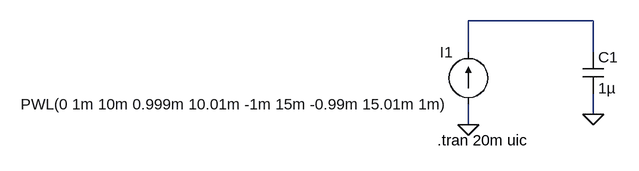
[diagram p0: schematic simple_integrate.asc]
simple_integrate.asc, the LTspice schematic file:
Version 4
SHEET 1 880 680
WIRE 384 64 192 64
WIRE 192 112 192 64
WIRE 384 112 384 64
WIRE 384 208 384 176
WIRE 192 224 192 192
FLAG 192 224 0
FLAG 384 208 0
SYMBOL current 192 192 R180
WINDOW 0 24 80 Left 2
WINDOW 3 24 0 Left 2
WINDOW 123 0 0 Left 2
WINDOW 39 0 0 Left 2
SYMATTR InstName I1
SYMATTR Value PWL(0 1m 10m 0.999m 10.01m -1m 15m -0.99m 15.01m 1m)
SYMBOL cap 368 112 R0
SYMATTR InstName C1
SYMATTR Value 1µ
TEXT 144 248 Left 2 !.tran 20m uic

The netlist it stands for:
* simple_integrate.asc
I1 0 N001 PWL(0 1m 10m 0.999m 10.01m -1m 15m -0.99m 15.01m 1m)
C1 N001 0 1µ
.tran 20m uic
.backanno
.end